# Altium schematic sheet Radio.SchDoc
size A4
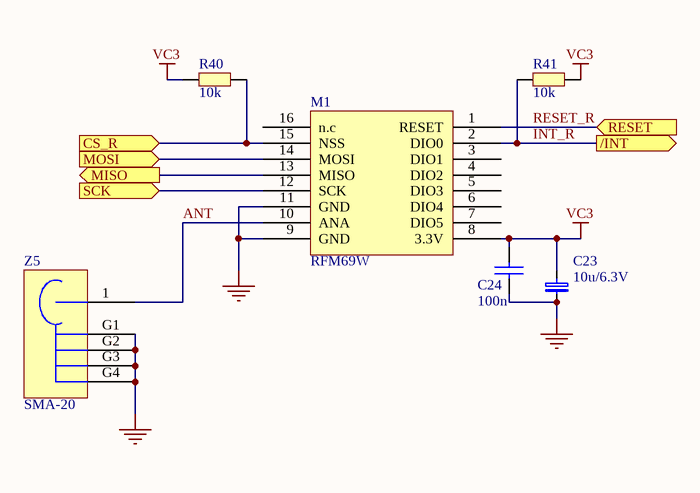
[diagram p0: Radio.SchDoc]

## Parts
C23  10u/6.3V  [CAP_A]
C24  100n  [0603C]
M1  RFM69W  [RFM69W]
R40  10k  [0603R]
R41  10k  [0603R]
Z5  SMA-20  [SMA-20_1]

## Ports
/INT (out), CS_R (in), MISO (out), MOSI (in), RESET (in), SCK (in)

## Nets
GND: C23.1 C24.1 M1.9(GND) M1.11(GND) Z5.G1 Z5.G2 Z5.G3 Z5.G4
VC3: C23.2 C24.2 M1.8(3.3V) R40.2 R41.1
ANT: M1.10(ANA) Z5.1
CS_R: M1.15(NSS) R40.1 ; port CS_R
INT_R: M1.2(DIO0) R41.2 ; port /INT
MISO: M1.13(MISO) ; port MISO
MOSI: M1.14(MOSI) ; port MOSI
RESET_R: M1.1(RESET) ; port RESET
SCK: M1.12(SCK) ; port SCK

Not connected (* = marked no-connect by the designer): M1 3(DIO1) 4(DIO2) 5(DIO3) 6(DIO4) 7(DIO5) 16(n.c)

## Library data of the parts
C23 = CAP_TANTAL_SMD: KONDENSATOR ELEKTROLITYCZNY TANTALOWY SMD
C24 = CAP: Capacitor
M1 = RFM96W
R40 R41 = RES3